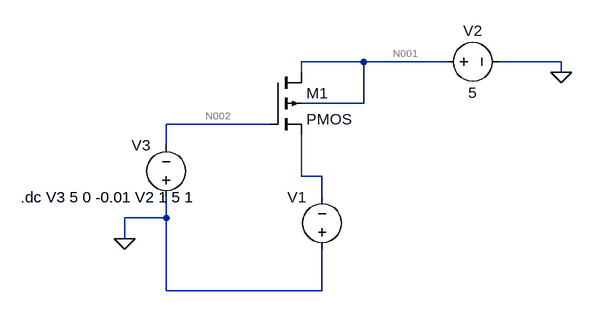
[diagram p0: schematic pmosrig.asc]
pmosrig.asc, the LTspice schematic file:
Version 4.1
SHEET 1 880 680
WIRE 304 80 208 80
WIRE 432 80 304 80
WIRE 608 80 512 80
WIRE 208 96 208 80
WIRE 608 96 608 80
WIRE 304 144 304 80
WIRE 304 144 208 144
WIRE 160 176 0 176
WIRE 0 208 0 176
WIRE 208 256 208 192
WIRE 240 256 208 256
WIRE 240 288 240 256
WIRE 0 320 0 288
WIRE 0 320 -64 320
WIRE -64 352 -64 320
WIRE 0 432 0 320
WIRE 240 432 240 368
WIRE 240 432 0 432
FLAG 608 96 0
FLAG -64 352 0
SYMBOL pmos4 160 96 R0
SYMATTR InstName M1
SYMBOL voltage 416 80 R270
WINDOW 0 32 56 VTop 2
WINDOW 3 -32 56 VBottom 2
SYMATTR InstName V2
SYMATTR Value 5
SYMBOL voltage 240 384 R180
WINDOW 0 24 96 Left 2
WINDOW 3 24 16 Left 2
SYMATTR InstName V1
SYMATTR Value ""
SYMBOL voltage 0 304 R180
WINDOW 0 24 96 Left 2
WINDOW 3 24 16 Left 2
SYMATTR InstName V3
SYMATTR Value ""
TEXT -224 288 Left 2 !.dc V3 5 0 -0.01 V2 1 5 1

The netlist it stands for:
* pmosrig.asc
M1 N001 N002 N003 N001 PMOS
V2 N001 0 5
V1 0 N003
V3 0 N002
.model NMOS NMOS
.model PMOS PMOS
.lib standard.mos
.dc V3 5 0 -0.01 V2 1 5 1
.backanno
.end

* Results of the author's LTspice run, read from the files saved beside the schematic
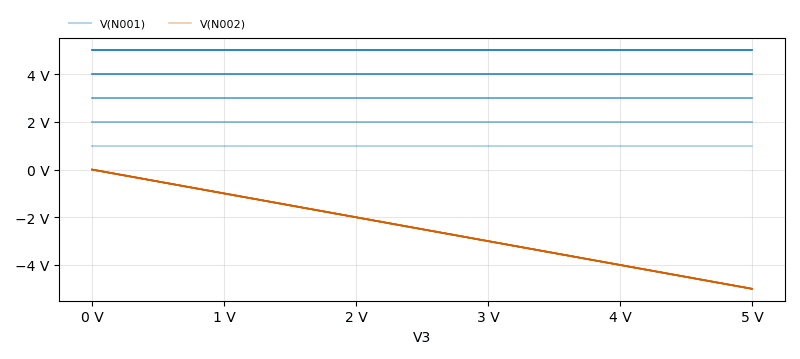
[diagram p1: DC transfer characteristic of pmosrig.asc, plotted from the saved traces]
* DC transfer characteristic, 5 runs:
*   V(N001) [V2=1]: 1 V at V3=5 V, 1 V at V3=0 V, min 1 V, max 1 V
*   V(N001) [V2=2]: 2 V at V3=5 V, 2 V at V3=0 V, min 2 V, max 2 V
*   V(N001) [V2=3]: 3 V at V3=5 V, 3 V at V3=0 V, min 3 V, max 3 V
*   V(N001) [V2=4]: 4 V at V3=5 V, 4 V at V3=0 V, min 4 V, max 4 V
*   V(N001) [V2=5]: 5 V at V3=5 V, 5 V at V3=0 V, min 5 V, max 5 V
*   V(N002) [V2=1]: -5 V at V3=5 V, 0 V at V3=0 V, min -5 V, max 0 V
*   V(N002) [V2=2]: -5 V at V3=5 V, 0 V at V3=0 V, min -5 V, max 0 V
*   V(N002) [V2=3]: -5 V at V3=5 V, 0 V at V3=0 V, min -5 V, max 0 V
*   V(N002) [V2=4]: -5 V at V3=5 V, 0 V at V3=0 V, min -5 V, max 0 V
*   V(N002) [V2=5]: -5 V at V3=5 V, 0 V at V3=0 V, min -5 V, max 0 V